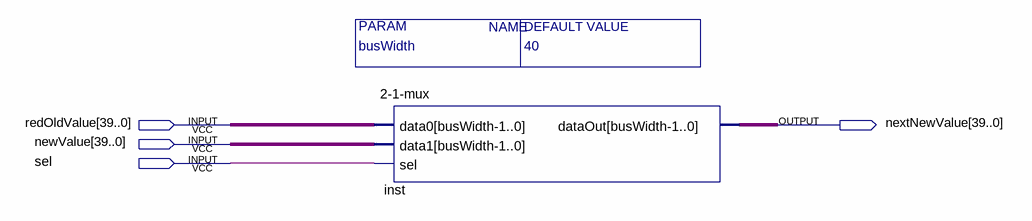
[diagram p0: schematic sheet]
// Quartus schematic 40bit_2-1-mux.bdf as structural Verilog: 1 symbols, 4 pins
module \40bit_2-1-mux  #(parameter busWidth = 40) (
  input  [39:0] redOldValue,
  input  [39:0] newValue,
  input  sel,
  output [39:0] nextNewValue
);

  \2-1-mux  inst (.data0(redOldValue), .data1(newValue), .sel(sel), .dataOut(nextNewValue));
endmodule
